# EAGLE design regulated_sensorTH_thesis (EAGLE 6.4)
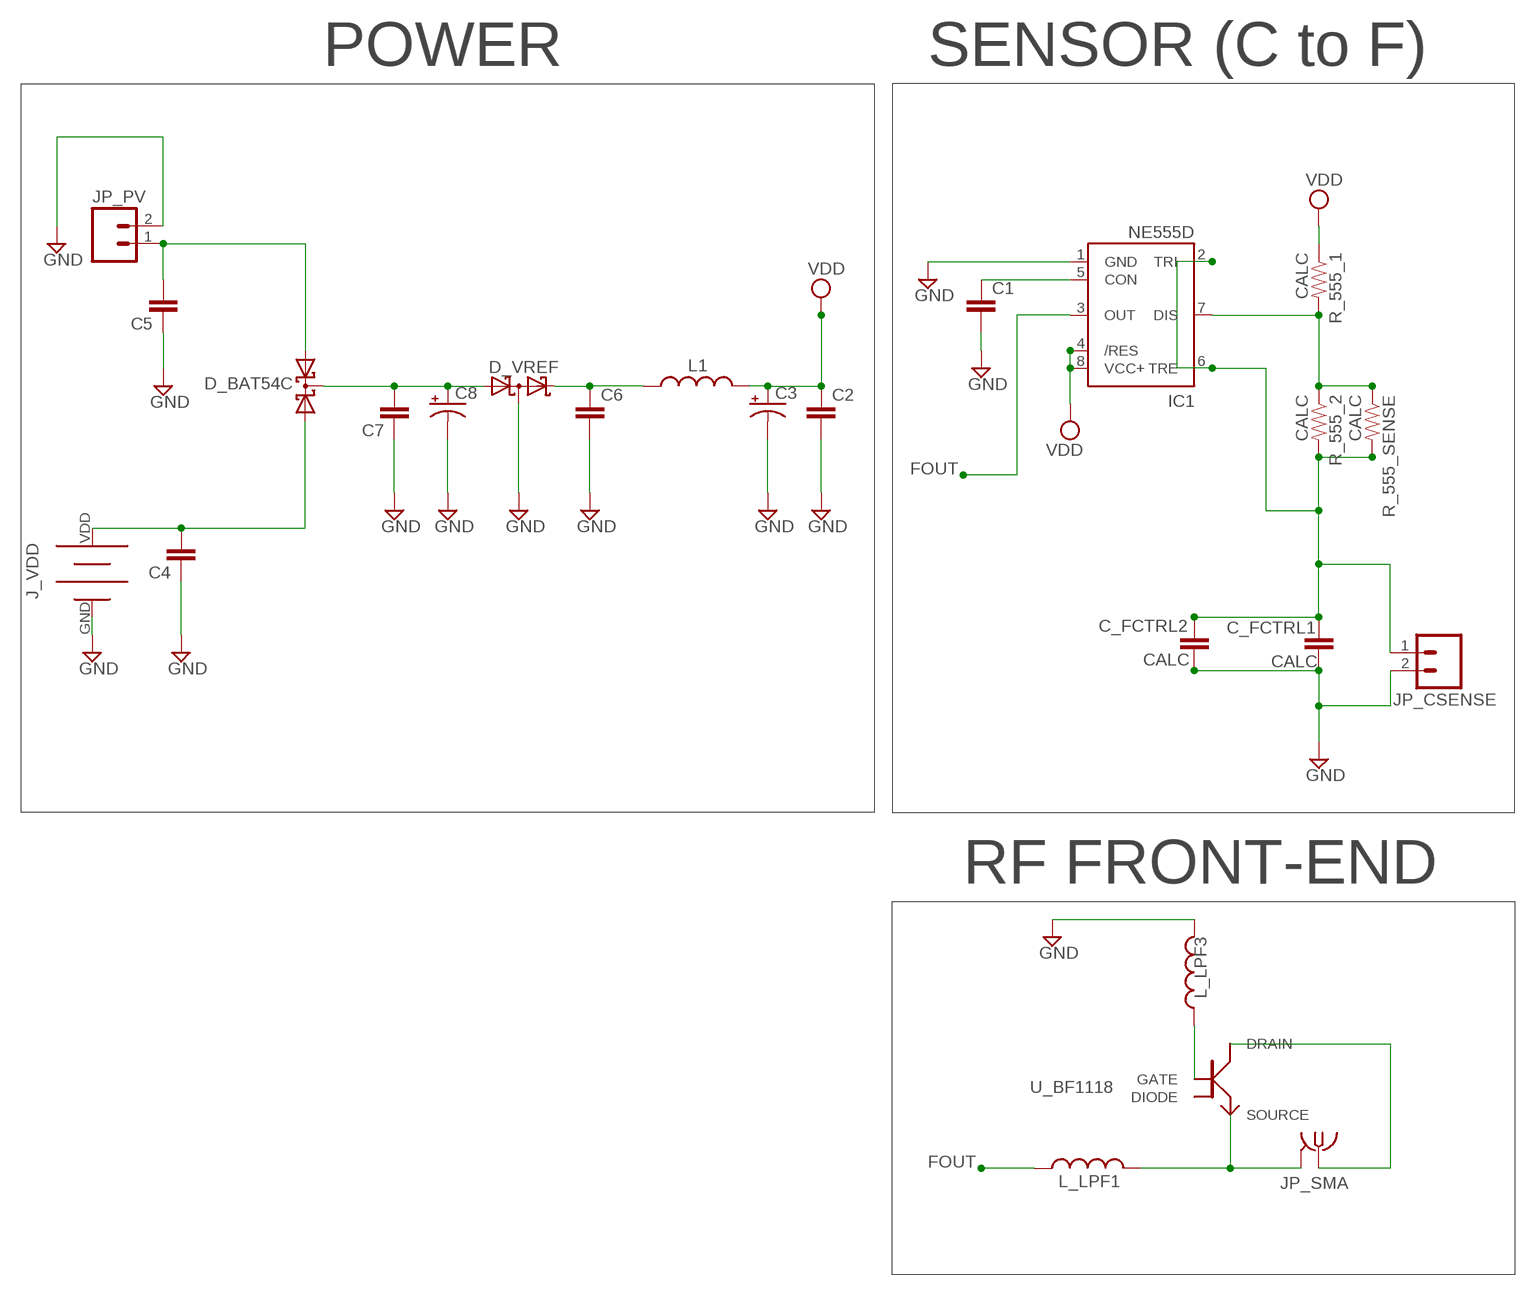
[diagram p0: schematic, sheet 1]

## Parts
C1  CAP0603-CAP  [0603-CAP]
C2  CAP0603-CAP  [0603-CAP]
C3  CAP_POL1206  [EIA3216]
C4  CAP0603-CAP  [0603-CAP]
C5  CAP0603-CAP  [0603-CAP]
C6  CAP0603-CAP  [0603-CAP]
C7  CAP0603-CAP  [0603-CAP]
C8  CAP_POL1206  [EIA3216]
C_FCTRL1  CALC  CAP0603-CAP  [0603-CAP]
C_FCTRL2  CALC  CAP0603-CAP  [0603-CAP]
D_BAT54C  BAT54C  [SOT23]
D_VREF  BAT54S  [SOT23]
IC1  NE555D  [SO08]
JP_CSENSE  M02LOCK  [1X02_LOCK]
JP_PV  M02LOCK  [1X02_LOCK]
JP_SMA  SMA-142-0701-881/886  [J502-ND-142-0701-881/886]
L1  INDUCTOR0603  [0603]
L_LPF1  INDUCTOR0603  [0603]
L_LPF3  INDUCTOR0603  [0603]
R_555_1  CALC  RESISTOR0805-RES  [0805]
R_555_2  CALC  RESISTOR0603-RES  [0603-RES]
R_555_SENSE  CALC  RESISTOR0603-RES  [0603-RES]
U$1  BATTERY_AAA_EAGLE_PLASTIC_DEVICES_DOUBLE  [BATTERY-AAA-50MM-DOUBLE]
U_BF1118  BF1118SOT343R_NXP  [SOT343R]

## Nets
FOUT: IC1.3(OUT) L_LPF1.1
GND: C1.2 C2.2 C3.C(-) C4.1 C5.1 C6.2 C7.1 C8.C(-) C_FCTRL1.2 C_FCTRL2.2 D_VREF.3(C1A2) IC1.1(GND) JP_CSENSE.2 JP_PV.2 L_LPF3.2 U$1.GND
N$3: C5.2 D_BAT54C.1(A1) JP_PV.1
N$7: C7.2 C8.A(+) D_BAT54C.3(CC) D_VREF.1(A1)
N$9: L_LPF3.1 U_BF1118.1(GATE)
N$10: C6.1 D_VREF.2(C2) L1.1
N$12: C_FCTRL1.1 C_FCTRL2.1 IC1.2(TRI) IC1.6(TRE) JP_CSENSE.1 R_555_2.2 R_555_SENSE.2
N$13: IC1.7(DIS) R_555_1.2 R_555_2.1 R_555_SENSE.1
N$14: C1.1 IC1.5(CON)
N$18: C4.2 D_BAT54C.2(A2) U$1.VDD
RF_FEEDBACK: JP_SMA.G@1 JP_SMA.G@2 JP_SMA.G@3 JP_SMA.G@4 L_LPF1.2 U_BF1118.3(SOURCE)
RF_IN: JP_SMA.1 U_BF1118.4(DRAIN)
VDD: C2.1 C3.A(+) IC1.4(/RES) IC1.8(VCC+) L1.2 R_555_1.1
Unconnected: U_BF1118.2(DIODE)

## Notes on the sheet
- POWER | SENSOR (C to F)
- J_VDD
- RF FRONT-END

## Library data of the parts
C1 C2 C4-C7 C_FCTRL1 C_FCTRL2 = SparkFun-Capacitors:CAP: Capacitor Standard 0603 ceramic capacitor, and 0.1" leaded capacitor.
C3 C8 = SparkFun-Capacitors:CAP_POL: Capacitor Polarized These are standard SMD and PTH capacitors. Normally 10uF, 47uF, and 100uF in electrolytic and tantalum varieties. Always verify the external diameter of the through hole cap, it varies with capacity, voltage, and manufacturer. The EIA devices should be standard.
D_BAT54C = diode:BAT54C: Schottky Diodes Source: Fairchild .. BAT54.pdf
D_VREF = diode:BAT54S: Schottky Diodes Pin connection corrected 2011-05-04 Source: Fairchild .. BAT54.pdf
IC1 = SparkFun-AnalogIC:NE555: General purpose bipolar Timer
JP_CSENSE JP_PV = SparkFun-Connectors:M02: Header 2 Standard 2-pin 0.1" header. Use with straight break away headers (SKU : PRT-00116), right angle break away headers (PRT-00553), swiss pins (PRT-00743), machine pins (PRT-00117), and female headers (PRT-00115). Molex polarized connector foot print use with SKU : PRT-08233 with associated crimp pins and housings.
JP_SMA = con-coax:SMA-: SMA 50 Ohm End Launch Jack Receptacle - Round Contact Johnson Components Source: www.johnsoncomponents.com .. J502-ND.pdf; MF: JOHNSON COMPONENTS; MPN: 142-0701-881; OC_FARNELL: 1608603; OC_NEWARK: 08B906
L1 L_LPF1 L_LPF3 = SparkFun-Passives:INDUCTOR: Inductors Basic Inductor/Choke - 0603 and 1206. Footprints are not proven and vary greatly between part numbers.
R_555_1 R_555_2 R_555_SENSE = SparkFun-Resistors:RESISTOR: Resistor Basic schematic elements and footprints for 0603, 1206, and PTH resistors.
U$1 = SparkFun-Electromechanical:BATTERY_AAA_EAGLE_PLASTIC_DEVICES_DOUBLE
U_BF1118 = rf_transistors:BF1118

## Board
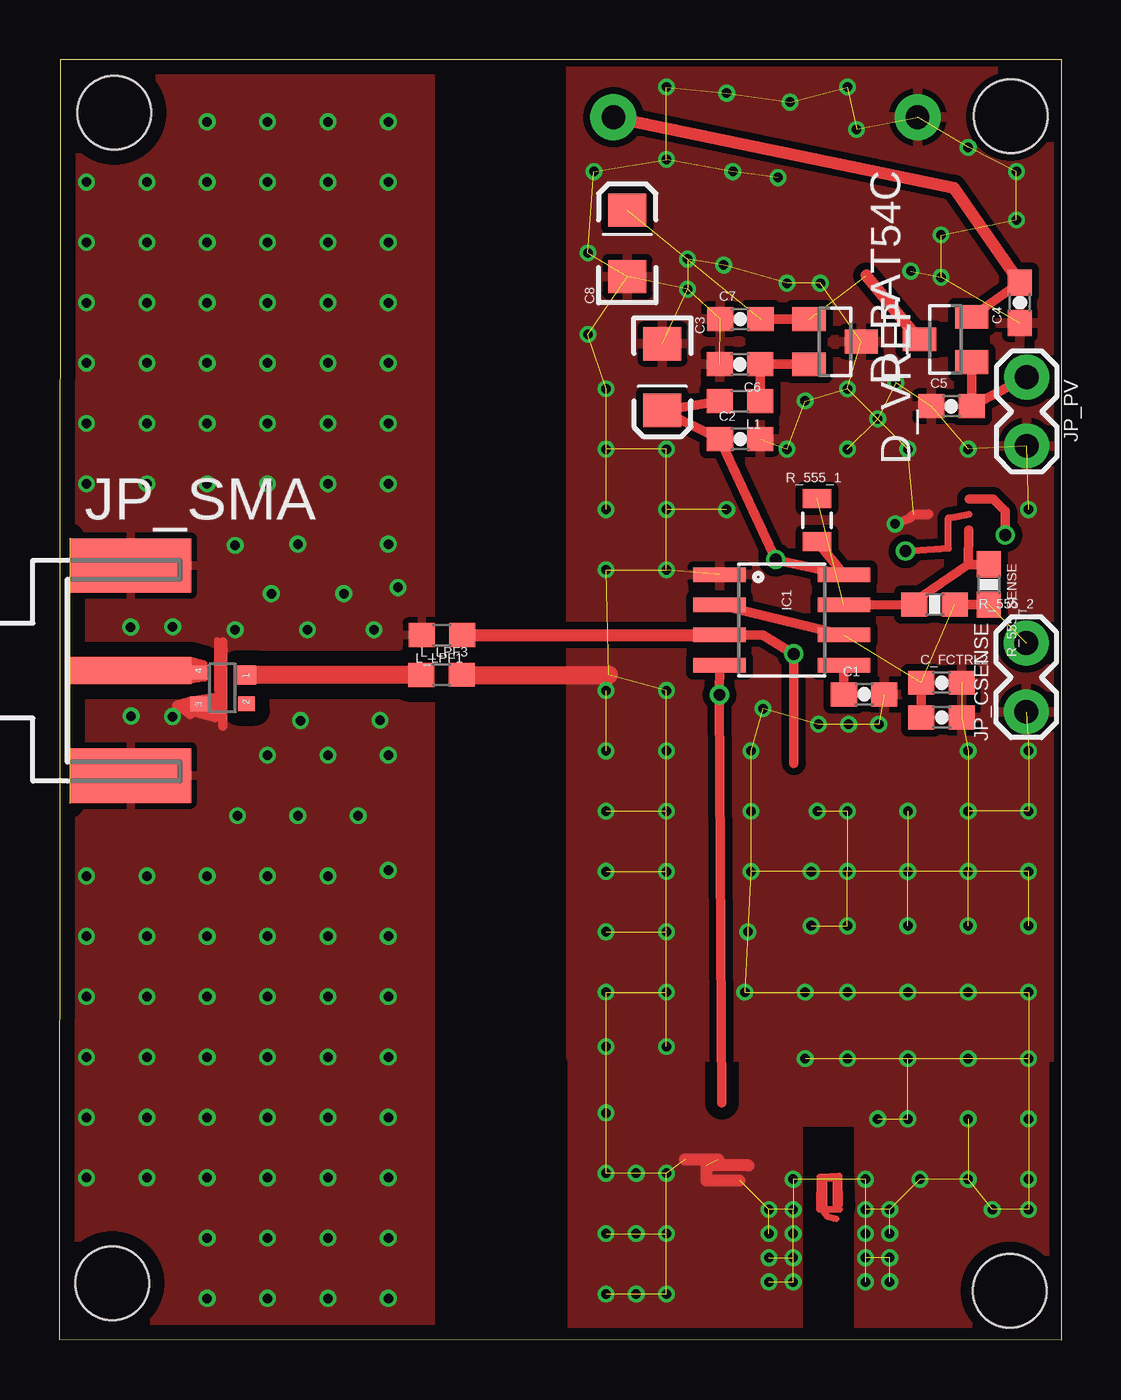
[diagram p1: board, top side]
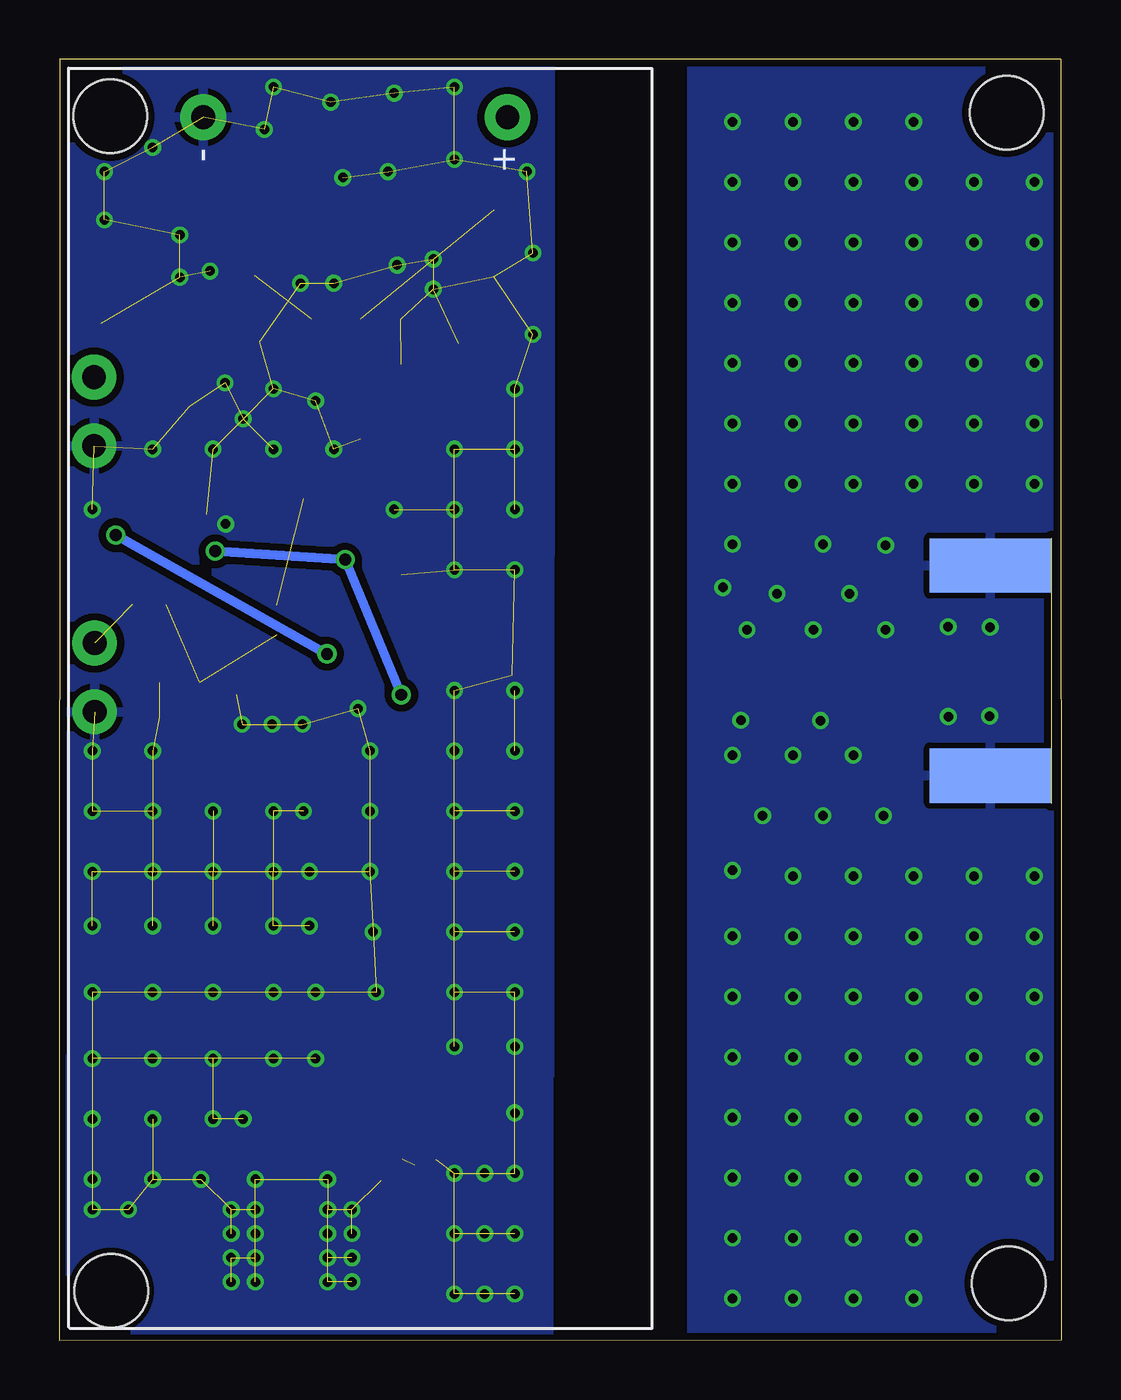
[diagram p2: board, bottom side, seen from below]

Size 42.16 x 53.91 mm. Coordinates in mm from the lower left corner, seen from the top.
Outline: 0.03,53.91 42.15,53.91 42.16,0 0,0.02 0.03,53.91
Copper layers (1*16): Top 0.035mm / dielectric 1.5mm / Bottom 0.035mm
Design rules "Fusion_eagle_rule_v1.1 *": minimum track width 10mil, minimum drill 12mil, track to track 12mil, track to pad 12mil, pad to pad 12mil, via to via 12mil, smd to smd 0mil, copper to edge 1mil, drill to drill 10mil, minimum pad ring 10mil, minimum via ring 6mil, stop-mask expansion 2mil, vias tented up to drill 100mil, thermal gap 10mil
Holes 3.1 mm at 2.31,51.66 2.22,2.4 39.99,2.07 40.02,51.51

### Footprints (pad centres in the part's own frame; a part is rotated, then mirrored left to right if it is on the bottom)
0603-CAP = smd 1.1 x 1: 1 -0.85,0; 2 0.85,0
EIA3216 = smd 1.4 x 1.6: A 1.4,0; C -1.4,0
SOT23 = smd 1 x 1.4: 1 -0.95,-1.1; 2 0.95,-1.1; 3 0,1.1
SO08 = smd 0.61 x 2.21: 1 -1.905,-2.616; 2 -0.635,-2.616; 3 0.635,-2.616; 4 1.905,-2.616; 5 1.905,2.616; 6 0.635,2.616; 7 -0.635,2.616; 8 -1.905,2.616
1X02_LOCK = drill 1 pad 1.88: 1 -0.178,0; 2 2.718,0
J502-ND-142-0701-881/886 = smd 5.08 x 1.143: 1 2.565,0 | smd 5.08 x 2.286: G@1 2.565,4.42; G@2 2.565,-4.42 | smd 5.08 x 2.286 bottom: G@3 2.565,4.42; G@4 2.565,-4.42
0603 = smd 1.1 x 1: 1 -0.85,0; 2 0.85,0
0805 = smd 0.8 x 1.2: 1 -0.9,0; 2 0.9,0
0603-RES = smd 1.1 x 1: 1 -0.85,0; 2 0.85,0
BATTERY-AAA-50MM-DOUBLE = drill 1 pad 1.93: GND 50.995,18.885; VDD 50.995,6.085
SOT343R = smd 0.8 x 0.8: 1 0.55,-1.07 | smd 0.6 x 0.7: 2 -0.66,-1.07; 3 -0.66,0.94; 4 0.65,0.94

### Placement (x,y rotation side)
C1  33.86,27.18 0 top
C2  28.64,37.93 0 top
C3  25.37,40.54 270 top
C4  40.41,43.66 90 top
C5  37.54,39.31 0 top
C6  28.63,41.08 180 top
C7  28.65,42.97 0 top
C8  23.89,46.16 90 top
C_FCTRL1  37.12,26.21 0 top
C_FCTRL2  37.12,27.67 0 top
D_BAT54C  37.29,42.12 90 top
D_VREF  32.64,42.02 270 top
IC1  30.4,30.31 270 top
JP_CSENSE  40.68,29.17 270 top
JP_PV  40.71,40.36 270 top
JP_SMA  0.43,28.18 0 top
L1  28.64,39.52 180 top
L_LPF1  16.09,29.68 180 top
L_LPF3  16.08,28 0.2 top
R_555_1  31.88,34.51 90 top
R_555_2  36.83,30.96 0 top
R_555_SENSE  39.11,31.81 270 top
U$1  17.23,0.48 90 bottom
U_BF1118  6.81,27.45 90 top

### Tracks (layer width: path | path; a pad name or v marks a point on that pad's centre or on a via)
FOUT  (via drill 0.5)
  Top 0.406: IC1.3 29.6,29.68 v30.91,28.89 30.91,24.28 | 38.28,35.41 39.29,35.41 39.8,34.89 v39.8,33.89
  Top 0.508: L_LPF1.1 22.9,29.68 IC1.3
  Bottom 0.406: v39.8,33.89 v30.91,28.89
GND  (via drill 0.4)  (143 unrouted)
  Top 0.406: 23.12,28 v23,27.34 | v35.17,34.35 35.78,34.61 35.96,34.76 36.56,34.76 36.58,34.77
  Top 0.508: 29,7.35 27.22,7.35 27.22,6.72 28.62,6.72 | 26.33,7.61 27.73,7.61
  Top 0.762: L_LPF3.2 23.12,28
  other vias: 23,4.48 23,7.02 25.54,7.02 31.94,25.92 33.21,25.92 34.48,25.92 23,9.56 25.54,14.64 23,14.64 25.54,17.18 23,17.18 23,19.72 25.54,19.72 33.16,17.44 33.16,19.72 35.7,19.72 23,22.26 25.54,22.26 35.7,17.44 38.24,19.72 33.16,22.26 35.7,22.26 38.24,22.26 40.78,22.26 38.24,24.8 40.78,24.8 23,24.8 25.54,24.8 40.78,19.72 25.54,27.34 25.54,32.42 23,32.42 23,34.96 25.54,34.96 28.08,34.96 23,37.5 25.54,37.5 33.16,37.5 30.62,37.5 33.16,40.04 35.7,37.5 38.24,37.5 40.78,34.96 30.62,44.49 40.27,49.19 38.24,50.2 30.24,48.93 33.16,52.74 28.08,52.49 25.54,52.74 25.54,49.7 28.33,49.19 22.24,45.76 22.24,42.33 23,40.04 29.1,24.8 29.6,26.58 29.1,22.26 29.1,19.72 28.97,17.18 28.84,14.64 33.16,14.64 31.38,14.64 35.7,14.64 38.24,14.64 38.24,17.44 40.78,17.44 40.78,14.64 31.38,11.85 33.16,11.85 35.7,11.85 38.24,11.85 40.78,11.85 40.78,9.31 38.24,9.31 35.7,9.31 34.43,9.31 33.92,6.77 38.24,6.77 40.78,6.77 40.78,5.5 25.54,4.48 25.54,1.94 23,1.94 33.92,5.5 33.92,4.48 33.92,3.47 33.92,2.45 30.87,2.45 30.87,3.47 30.87,4.48 30.87,5.5 29.86,2.45 29.86,3.47 29.86,4.48 29.86,5.5 34.94,2.45 34.94,3.47 34.94,4.48 34.94,5.5 24.27,1.94 24.27,4.48 24.27,7.02 36.21,6.77 31.64,17.44 31.64,19.72 31.89,22.26 23,12.36 25.54,12.36 39.26,5.5 30.87,6.77 30.75,52.11 33.54,50.97 22.49,49.19 37.1,46.52 37.1,44.74 35.83,45 32.02,44.49 31.38,39.54 35.19,40.3 34.43,38.77 40.27,47.16 26.43,45.5 27.95,45.25 26.43,44.23
  pour Bottom (isolate 0.305): 21.51,54.85 47.19,54.97 47.19,11.15 21.53,11.15
  pour Top (isolate 0.305): 21.51,54.85 21.51,11.92 41.83,11.92 42.08,54.85
  pour Bottom (isolate 0.254): 21.51,11.92 21.51,-1.29 43.1,-1.29 43.1,11.92
  pour Top (isolate 0.508): 21.51,13.07 21.51,0.24 31.16,0.24 31.16,9.13 33.57,9.13 33.57,0.24 42.33,0.24 42.33,13.07
N$3
  Top 0.406: D_BAT54C.1 C5.2 JP_PV.1
N$7  (2 unrouted)
  Top 0.406: D_VREF.1 C7.2
  Top 0.508: D_BAT54C.3 33.95,44.82
N$9
  Top 0.762: L_LPF3.1 U_BF1118.1
N$10
  Top 0.406: L1.1 C6.1 D_VREF.2
N$12  (3 unrouted)
  Top 0.406: IC1.6 IC1.2 | C_FCTRL1.1 C_FCTRL2.1 | R_555_2.2 R_555_SENSE.2
N$13  (1 unrouted)
  Top 0.305: R_555_SENSE.1 39,32.66
  Top 0.406: IC1.7 R_555_2.1 35.97,31.09 38.24,32.65 | 38.24,32.65 38.27,34.1 | 39,32.66 38.24,32.65
N$14
  Top 0.406: C1.1 IC1.5
N$17
  Top 0.254: 6.04,27.86 6.12,27.86 6.12,28.41 6.1,28.47 5.52,28.63
N$18
  Top 0.406: D_BAT54C.2 C4.2
  Top 0.508: U$1.VDD 37.63,48.5 C4.2
RF_FEEDBACK  (via drill 0.4)
  Top 0.254: 6.77,27.42 6.84,27.42 6.84,28.78 6.85,28.78 6.85,27.4 6.78,27.4 6.78,28.91 | 6.65,27.31 6.64,29.45 | 6.64,29.33 6.81,28.55 6.81,27.12 5.9,26.8 6.86,27.22 6.83,26.36 6.86,27.53 6.72,26.39 6.68,26.95 6.25,26.73 6.15,26.26 6.46,26.72 6.52,26.54 6.3,26.36 6.04,26.45 6.84,26.26 6.89,26.04 | 6.87,28.74 6.88,29.07 6.89,29.17 6.72,29.17
  Top 0.406: U_BF1118.3 5.5,26.34 5.13,26.65 5.9,26.8 | 6.81,27.12 6.64,27.07 | 6.64,27.07 5.16,26.59 6.55,26.2 6.78,27.4 | 6.87,25.84 6.87,29.39 | 4.93,26.7 5.48,26.87 6.64,27.07 | 6.84,28.78 6.88,29.07
  other vias: 6.22,1.76 8.76,1.76 11.3,1.76 13.84,1.76 6.22,4.3 8.76,4.3 11.3,4.3 13.84,4.3 13.84,6.84 11.3,6.84 8.76,6.84 6.22,6.84 3.68,6.84 1.14,6.84 1.14,9.38 3.68,9.38 6.22,9.38 8.76,9.38 11.3,9.38 13.84,9.38 13.84,11.92 11.3,11.92 8.76,11.92 6.22,11.92 3.68,11.92 1.14,11.92 1.14,14.46 3.68,14.46 6.22,14.46 8.76,14.46 11.3,14.46 13.84,14.46 1.14,17 3.68,17 6.22,17 8.76,17 11.3,17 13.84,17 13.84,19.77 11.3,19.54 8.76,19.54 6.22,19.54 3.68,19.54 1.14,19.54 7.49,22.08 10.03,22.08 12.57,22.08 13.84,24.62 11.3,24.62 8.76,24.62 13.49,26.09 10.14,26.08 3,30.02 3.02,26.27 4.77,30.03 4.76,26.25 1.14,36.05 3.68,36.05 6.22,36.05 8.76,36.05 11.3,36.05 13.84,36.05 13.84,38.59 11.3,38.59 8.76,38.59 6.22,38.59 3.68,38.59 1.14,38.59 1.14,41.13 3.68,41.13 6.22,41.13 8.76,41.13 11.3,41.13 13.84,41.13 13.84,43.67 11.3,43.67 8.76,43.67 6.22,43.67 3.68,43.67 1.14,43.67 1.14,46.21 3.68,46.21 6.22,46.21 8.76,46.21 11.3,46.21 13.84,46.21 13.84,48.75 11.3,48.75 8.76,48.75 6.22,48.75 3.68,48.75 1.14,48.75 6.22,51.29 8.76,51.29 11.3,51.29 13.84,51.29 13.84,33.51 10.03,33.51 7.39,29.9 8.92,31.42 10.44,29.9 11.97,31.42 13.24,29.9 7.39,33.46 14.25,31.68
  pour Top (isolate 0.635, rank 4): -8.5,54.38 -8.5,-0.99 15.63,-0.99 15.63,54.38
  pour Bottom (isolate 0.305): -2.34,54.97 -2.34,-0.91 15.56,-0.91 15.56,54.97
RF_IN
  Top 0.254: U_BF1118.4 6.1,28.42 5.49,28.62 5.55,28.33 5.67,28.39 6.1,27.84 5.5,27.73 JP_SMA.1
RF_IN_ALT
  Top 0.279: 32.18,5.63 32.18,6.81 32.67,6.81 32.67,5.71 32.84,5.7 32.8,6.91 31.99,6.88 31.97,5.66 | 31.97,5.66 32.32,5.19 32.58,5.13 32.68,5.12 | 32.83,5.51 32.17,5.51 | 32.17,5.51 31.97,5.51 | 31.97,5.66 32.17,5.51
VDD  (via drill 0.5)
  Top 0.305: v35.6,33.21 37.41,33.34 37.41,34.61 38.28,34.77
  Top 0.406: R_555_1.1 IC1.8 30.17,32.83 v30.14,32.85 C2.1 C3.A L1.2 | IC1.4 v27.77,27.16 27.87,10
  Bottom 0.406: v27.77,27.16 v30.14,32.85 v35.6,33.21